# Altium schematic sheet analog_signal.SchDoc
size A2; Organization: Altium Limited; Address1: L3, 12a Rodborough Rd; Address2: Frenchs Forest; Address3: NSW; Address4: Australia 2086
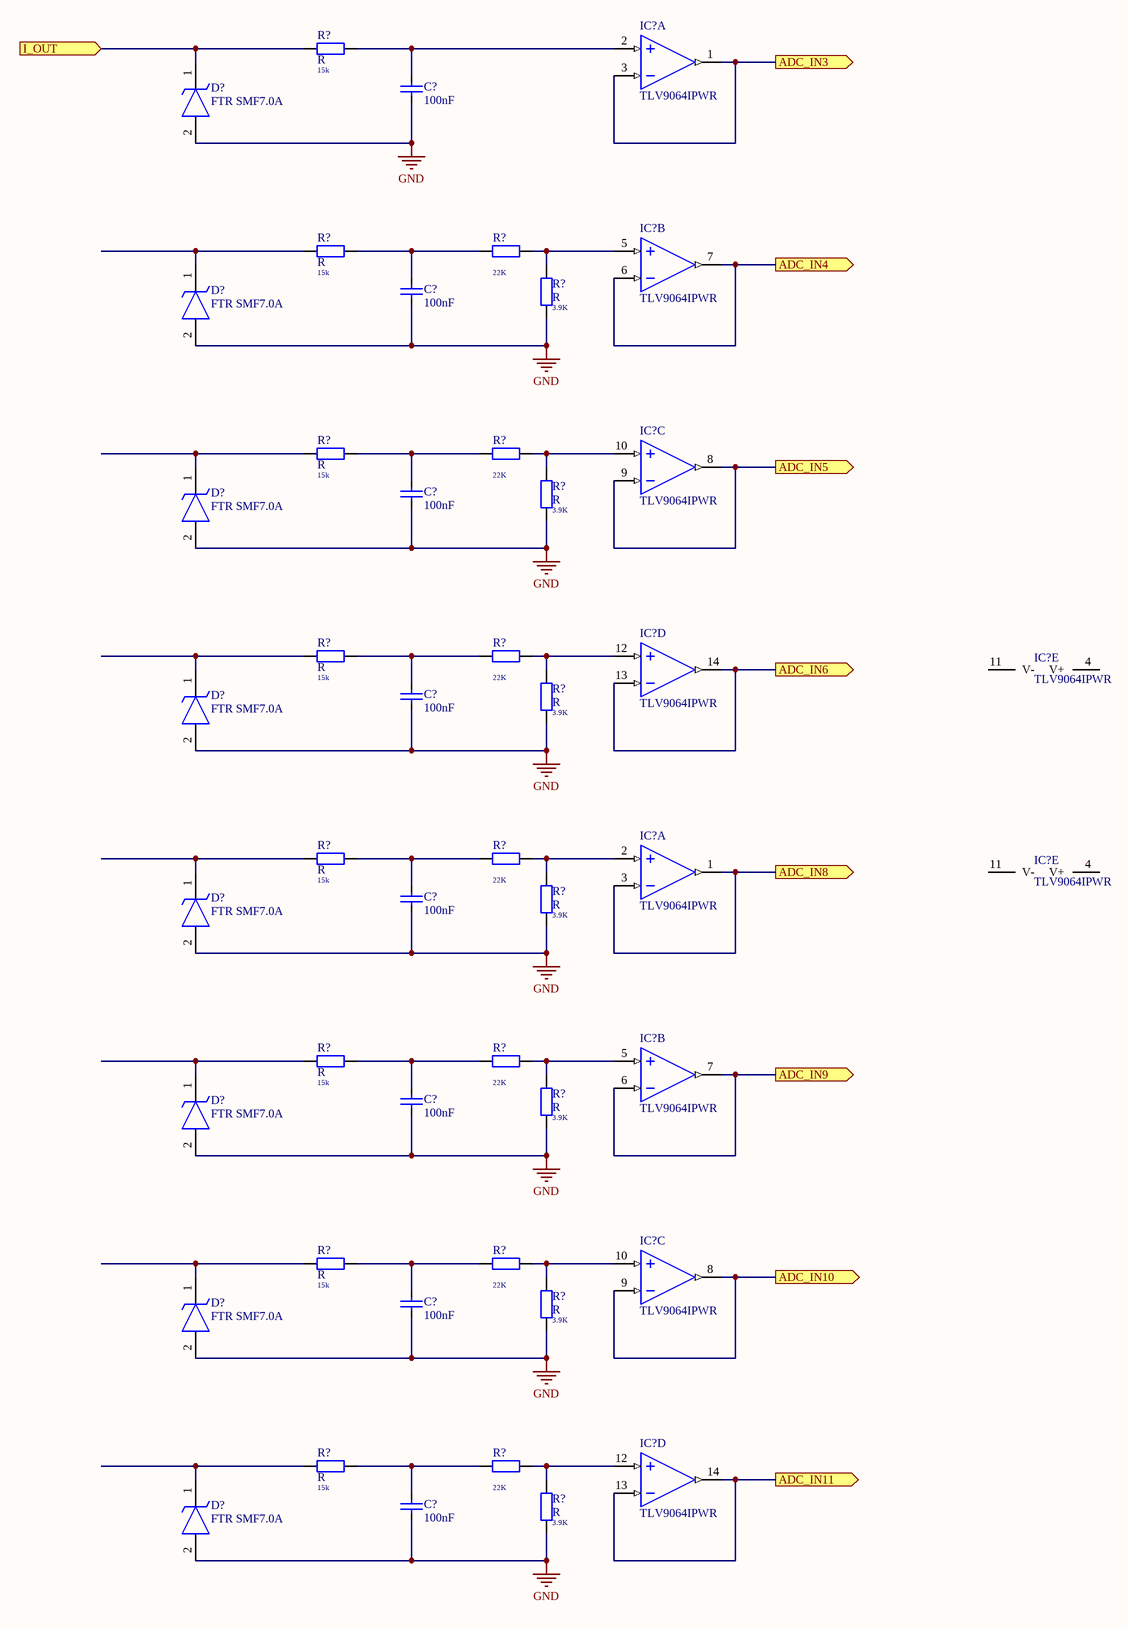
[diagram p0: analog_signal.SchDoc]

## Parts
(Parts that share a designator on the sheet are numbered #1, #2 ... from top to bottom, then left to right.)
C?#1  value 100nF  [CAPC3216X18N]  (hidden comment: C)
C?#2  value 100nF  [CAPC3216X18N]  (hidden comment: C)
C?#3  value 100nF  [CAPC3216X18N]  (hidden comment: C)
C?#4  value 100nF  [CAPC3216X18N]  (hidden comment: C)
C?#5  value 100nF  [CAPC3216X18N]  (hidden comment: C)
C?#6  value 100nF  [CAPC3216X18N]  (hidden comment: C)
C?#7  value 100nF  [CAPC3216X18N]  (hidden comment: C)
C?#8  value 100nF  [CAPC3216X18N]  (hidden comment: C)
D?#1  FTR SMF7.0A  [SMF70ATP]
D?#2  FTR SMF7.0A  [SMF70ATP]
D?#3  FTR SMF7.0A  [SMF70ATP]
D?#4  FTR SMF7.0A  [SMF70ATP]
D?#5  FTR SMF7.0A  [SMF70ATP]
D?#6  FTR SMF7.0A  [SMF70ATP]
D?#7  FTR SMF7.0A  [SMF70ATP]
D?#8  FTR SMF7.0A  [SMF70ATP]
IC?#1  TLV9064IPWR  [SOP65P640X120-14N]  (part A of 5)
IC?#2  TLV9064IPWR  [SOP65P640X120-14N]  (part B of 5)
IC?#3  TLV9064IPWR  [SOP65P640X120-14N]  (part C of 5)
IC?#4  TLV9064IPWR  [SOP65P640X120-14N]  (part D of 5)
IC?#5  TLV9064IPWR  [SOP65P640X120-14N]  (part E of 5)
IC?#6  TLV9064IPWR  [SOP65P640X120-14N]  (part A of 5)
IC?#7  TLV9064IPWR  [SOP65P640X120-14N]  (part E of 5)
IC?#8  TLV9064IPWR  [SOP65P640X120-14N]  (part B of 5)
IC?#9  TLV9064IPWR  [SOP65P640X120-14N]  (part C of 5)
IC?#10  TLV9064IPWR  [SOP65P640X120-14N]  (part D of 5)
R?#1  R  value 15k  [RESC1005X04N]
R?#2  R  value 15k  [RESC1005X04N]
R?#3  value 22K  [RESC1608X06N]  (hidden comment: R)
R?#4  R  value 3.9K  [RESC1005X04N]
R?#5  R  value 15k  [RESC1005X04N]
R?#6  value 22K  [RESC1608X06N]  (hidden comment: R)
R?#7  R  value 3.9K  [RESC1005X04N]
R?#8  R  value 15k  [RESC1005X04N]
R?#9  value 22K  [RESC1608X06N]  (hidden comment: R)
R?#10  R  value 3.9K  [RESC1005X04N]
R?#11  R  value 15k  [RESC1005X04N]
R?#12  value 22K  [RESC1608X06N]  (hidden comment: R)
R?#13  R  value 3.9K  [RESC1005X04N]
R?#14  R  value 15k  [RESC1005X04N]
R?#15  value 22K  [RESC1608X06N]  (hidden comment: R)
R?#16  R  value 3.9K  [RESC1005X04N]
R?#17  R  value 15k  [RESC1005X04N]
R?#18  value 22K  [RESC1608X06N]  (hidden comment: R)
R?#19  R  value 3.9K  [RESC1005X04N]
R?#20  R  value 15k  [RESC1005X04N]
R?#21  value 22K  [RESC1608X06N]  (hidden comment: R)
R?#22  R  value 3.9K  [RESC1005X04N]

## Ports
ADC_IN3 (out), ADC_IN4 (out), ADC_IN5 (out), ADC_IN6 (out), ADC_IN8 (out), ADC_IN9 (out), ADC_IN10 (out), ADC_IN11 (out), I_OUT (in)

## Nets
GND: C?#1.1 C?#2.1 C?#3.1 C?#4.1 C?#5.1 C?#6.1 C?#7.1 C?#8.1 D?#1.2(A) D?#2.2(A) D?#3.2(A) D?#4.2(A) D?#5.2(A) D?#6.2(A) D?#7.2(A) D?#8.2(A) R?#4.1 R?#7.1 R?#10.1 R?#13.1 R?#16.1 R?#19.1 R?#22.1
ADC_IN3: IC?#1.1(OUT1) IC?#1.3(IN1+) ; port ADC_IN3
ADC_IN4: IC?#2.6(IN2-) IC?#2.7(OUT2) ; port ADC_IN4
ADC_IN5: IC?#3.8(OUT3) IC?#3.9(IN3-) ; port ADC_IN5
ADC_IN6: IC?#4.13(IN4-) IC?#4.14(OUT4) ; port ADC_IN6
ADC_IN8: IC?#6.1(OUT1) IC?#6.3(IN1+) ; port ADC_IN8
ADC_IN9: IC?#8.6(IN2-) IC?#8.7(OUT2) ; port ADC_IN9
ADC_IN10: IC?#9.8(OUT3) IC?#9.9(IN3-) ; port ADC_IN10
ADC_IN11: IC?#10.13(IN4-) IC?#10.14(OUT4) ; port ADC_IN11
I_OUT: D?#1.1(K) R?#1.1 ; port I_OUT
NetC?#1_2: C?#1.2 IC?#1.2(IN1-) R?#1.2
NetC?#2_2: C?#2.2 R?#2.2 R?#3.1
NetC?#3_2: C?#3.2 R?#5.2 R?#6.1
NetC?#4_2: C?#4.2 R?#8.2 R?#9.1
NetC?#5_2: C?#5.2 R?#11.2 R?#12.1
NetC?#6_2: C?#6.2 R?#14.2 R?#15.1
NetC?#7_2: C?#7.2 R?#17.2 R?#18.1
NetC?#8_2: C?#8.2 R?#20.2 R?#21.1
NetD?#2_1: D?#2.1(K) R?#2.1
NetD?#3_1: D?#3.1(K) R?#5.1
NetD?#4_1: D?#4.1(K) R?#8.1
NetD?#5_1: D?#5.1(K) R?#11.1
NetD?#6_1: D?#6.1(K) R?#14.1
NetD?#7_1: D?#7.1(K) R?#17.1
NetD?#8_1: D?#8.1(K) R?#20.1
NetIC?#2_5: IC?#2.5(IN2+) R?#3.2 R?#4.2
NetIC?#3_10: IC?#3.10(IN3+) R?#6.2 R?#7.2
NetIC?#4_12: IC?#4.12(IN4+) R?#9.2 R?#10.2
NetIC?#6_2: IC?#6.2(IN1-) R?#12.2 R?#13.2
NetIC?#8_5: IC?#8.5(IN2+) R?#15.2 R?#16.2
NetIC?#9_10: IC?#9.10(IN3+) R?#18.2 R?#19.2
NetIC?#10_12: IC?#10.12(IN4+) R?#21.2 R?#22.2

Not connected (* = marked no-connect by the designer): IC?#5 4(V+) 11(V-); IC?#7 4(V+) 11(V-)

## Notes on the sheet
- Title
- Size:
- Date:
- File:
- A2
- Number:
- Time:
- Revision:
- Sheet
- of

## Library data of the parts
C?#1-C?#8 = C: Parameter 2: 06033C104KAT4A; Link: https://www.lcsc.com/product-detail/Multilayer-Ceramic-Capacitors-MLCC-SMD-SMT_Kyocera-AVX-06033C104KAT4A_C2167104.html
D?#1-D?#8 = SMF7.0A-TP: TVS Diode (Uni-directional); Manufacturer_Name: MCC; Datasheet Link: https://www.lcsc.com/datasheet/lcsc_datasheet_2304140030_FTR-SMF7-0A_C707468.pdf; Height: 1.35mm; Manufacturer_Part_Number: FTR SMF7.0A; Arrow Part Number: FTR SMF7.0A; Arrow Price/Stock: https://www.lcsc.com/product-detail/ESD-and-Surge-Protection-TVS-ESD_FTR-SMF7-0A_C707468.html
IC?#1-IC?#10 = TLV9064IPWR: Integrated Circuit; Manufacturer_Name: Texas Instruments; Datasheet Link: http://www.ti.com/lit/ds/symlink/tlv9064.pdf; Height: 1.2mm; Manufacturer_Part_Number: TLV9064IPWR; Mouser Part Number: 595-TLV9064IPWR; Mouser Price/Stock: https://www.mouser.co.uk/ProductDetail/Texas-Instruments/TLV9064IPWR?qs=W0yvOO0ixfHY9ZUvwjcceA%3D%3D; Arrow Part Number: TLV9064IPWR; Arrow Price/Stock: https://www.arrow.com/en/products/tlv9064ipwr/texas-instruments?utm_currency=USD&region=nac
R?#3 R?#6 R?#9 R?#12 R?#15 R?#18 R?#21 = R: MPN: 0603WAF2202T5E; Link: https://www.lcsc.com/product-detail/Chip-Resistor-Surface-Mount_UNI-ROYAL-Uniroyal-Elec-0603WAF2202T5E_C31850.html
R?#4 R?#7 R?#10 R?#13 R?#16 R?#19 R?#22 = R: MPN: 0603WAF3901T5E; Link: https://www.lcsc.com/product-detail/Chip-Resistor-Surface-Mount_UNI-ROYAL-Uniroyal-Elec-0603WAF3901T5E_C23018.html
R?#1 R?#2 R?#5 R?#8 R?#11 R?#14 R?#17 R?#20 = R: MPN: *; Link: *